# EAGLE design SD Card Shield (EAGLE 6.1)
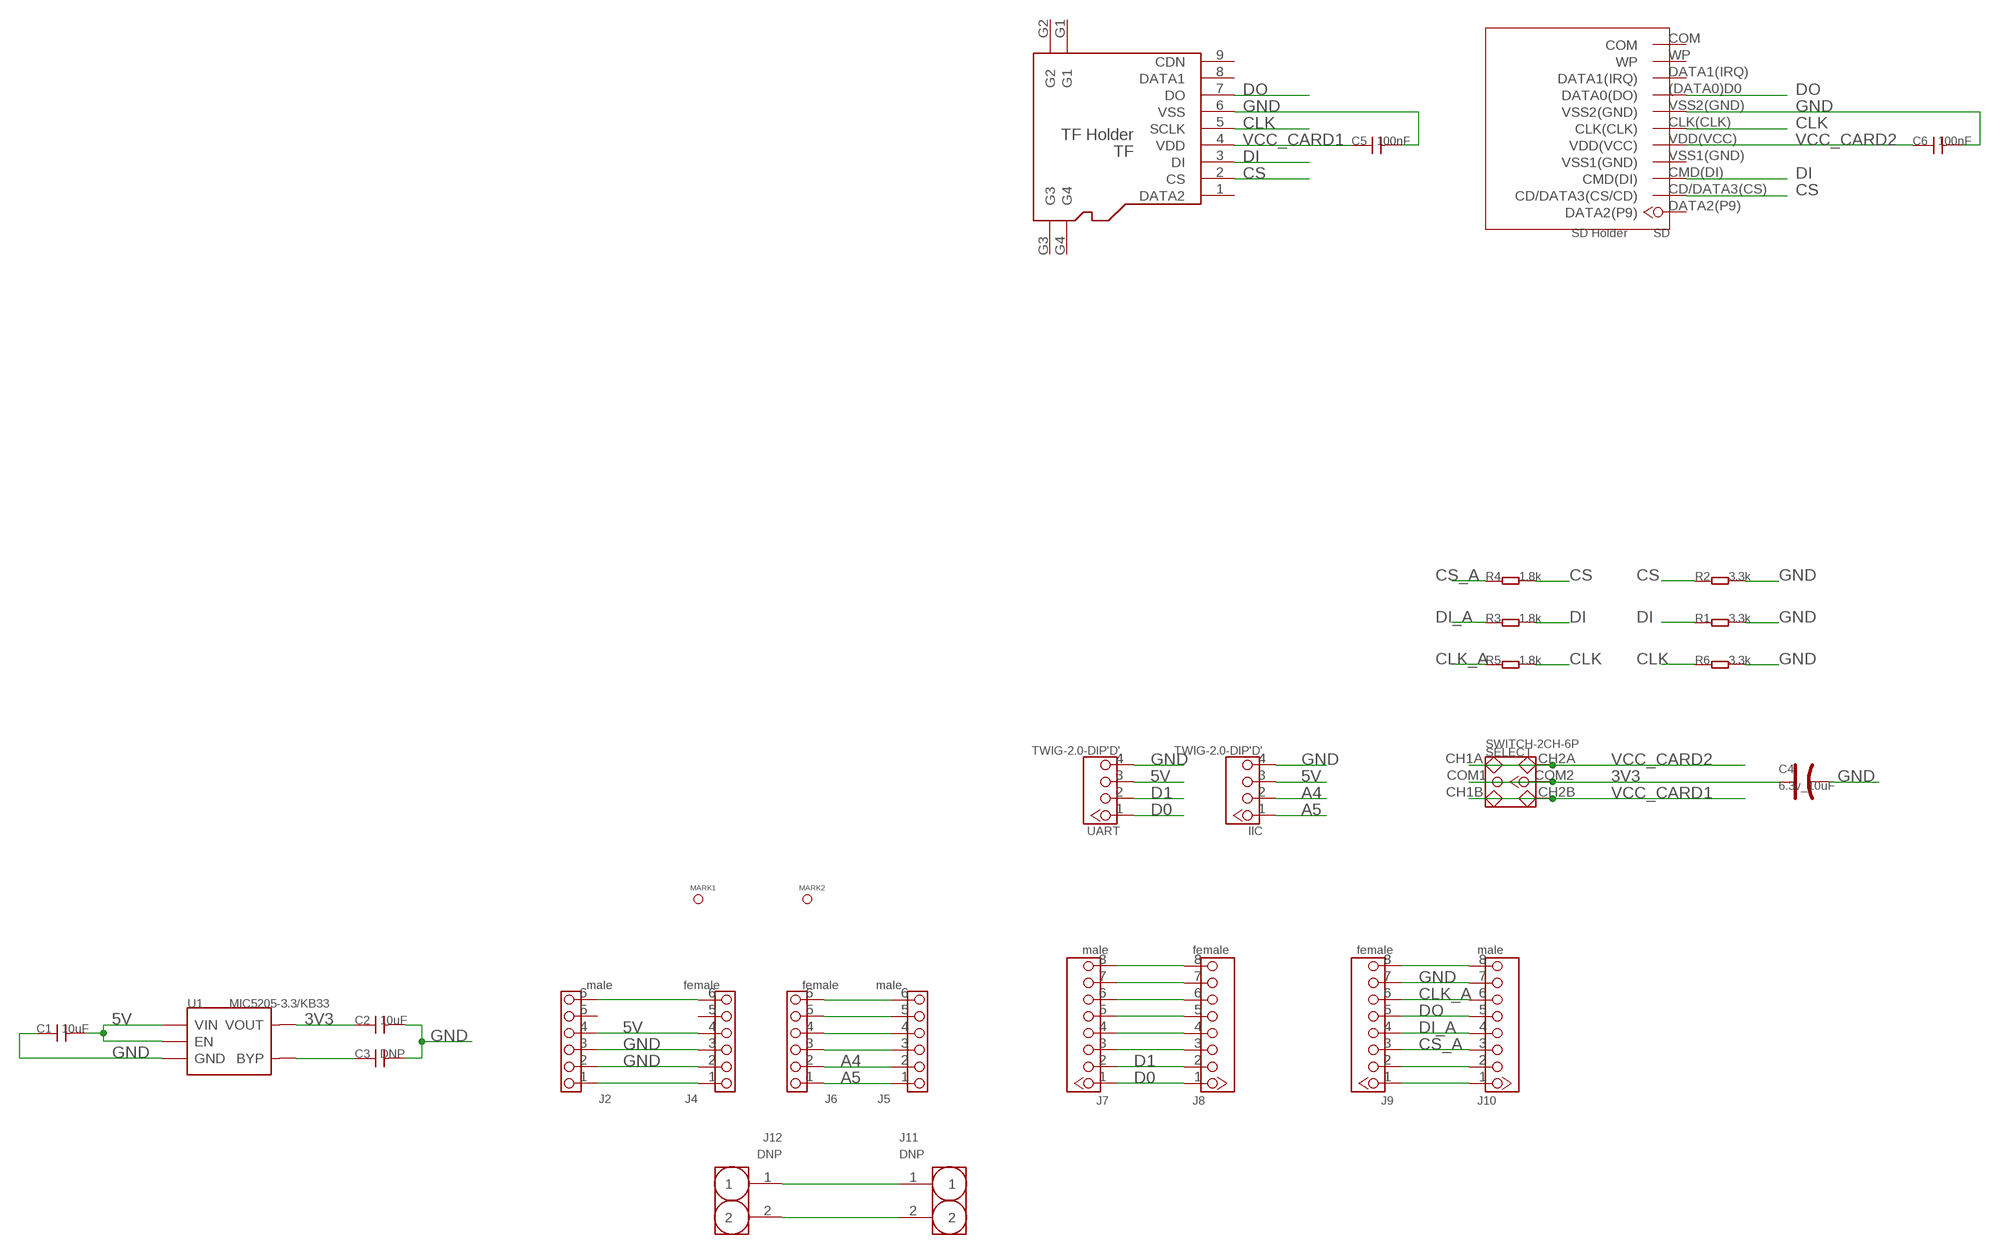
[diagram p0: schematic, sheet 1]

## Parts
C1  10uF  C-0805  [0805]
C2  10uF  C-0805  [0805]
C3  DNP  C-0603  [0603]
C4  6.3v_10uF  CAP-AVX-A  [AVX-A]
C5  100nF  C-0603  [0603]
C6  100nF  C-0603  [0603]
IIC  TWIG-2.0-DIP'D'  [2.0_1X4_90]
J2  male  HEADER-6PSTANDARD/2.54  [2.54_6P]
J4  female  HEADER-6PSTANDARD/2.54  [2.54_6P]
J5  male  HEADER-6PSTANDARD/2.54  [2.54_6P]
J6  female  HEADER-6PSTANDARD/2.54  [2.54_6P]
J7  male  HEADER-8P2.54  [CK_1X8]
J8  female  HEADER-8P2.54  [CK_1X8]
J9  female  HEADER-8P2.54  [CK_1X8]
J10  male  HEADER-8P2.54  [CK_1X8]
J11  DNP  HEADER-2P2.54  [65*35]
J12  DNP  HEADER-2P2.54  [65*35]
MARK1  DNP  PAD-MARK  [ROUND-MARK-1.0]
MARK2  DNP  PAD-MARK  [ROUND-MARK-1.0]
R1  3.3k  R-0603  [0603]
R2  3.3k  R-0603  [0603]
R3  1.8k  R-0603  [0603]
R4  1.8k  R-0603  [0603]
R5  1.8k  R-0603  [0603]
R6  3.3k  R-0603  [0603]
SD  SD Holder  SDCARDEXTDEVICE  [SDCARDEXTPACKAGE]
SELECT  SWITCH-2CH-6P  [6P-2CH-2.54-7.6X3.0]
TF  TF Holder  HOLDER-MICROSD-9P  [9P-SMD-W/-RING]
U1  MIC5205-3.3/KB33  MIC5205  [SOT23-5]
UART  TWIG-2.0-DIP'D'  [2.0_1X4_90]

## Nets
3V3: C2.1 C4.+ SELECT.COM1 SELECT.COM2 U1.5(VOUT)
5V: C1.2 IIC.3 J2.4 J4.4 U1.1(VIN) U1.3(EN) UART.3
A4: IIC.2 J5.2 J6.2
A5: IIC.1 J5.1 J6.1
CLK: R5.2 R6.1 SD.CLK(CLK) TF.5(SCLK)
CLK_A: J9.6 J10.6 R5.1
CS: R2.1 R4.2 SD.CD/DATA3(CS)(CD/DATA3(CS/CD)) TF.2(CS)
CS_A: J9.3 J10.3 R4.1
D0: J7.1 J8.1 UART.1
D1: J7.2 J8.2 UART.2
DI: R1.1 R3.2 SD.CMD(DI) TF.3(DI)
DI_A: J9.4 J10.4 R3.1
DO: J9.5 J10.5 SD.(DATA0)D0(DATA0(DO)) TF.7(DO)
GND: C1.1 C2.2 C3.2 C4.- C5.2 C6.2 IIC.4 J2.2 J2.3 J4.2 J4.3 J9.7 J10.7 R1.2 R2.2 R6.2 SD.VSS2(GND) TF.6(VSS) U1.2(GND) UART.4
N$1: J2.1 J4.1
N$2: J11.1 J12.1
N$3: J11.2 J12.2
N$4: C3.1 U1.4(BYP)
N$6: J2.6 J4.6
N$9: J5.3 J6.3
N$10: J5.4 J6.4
N$11: J5.5 J6.5
N$12: J5.6 J6.6
N$14: J7.3 J8.3
N$15: J7.4 J8.4
N$16: J7.5 J8.5
N$17: J7.6 J8.6
N$18: J7.7 J8.7
N$19: J7.8 J8.8
N$21: J9.2 J10.2
N$27: J9.8 J10.8
N$28: J9.1 J10.1
VCC_CARD1: C5.1 SELECT.CH1B SELECT.CH2B TF.4(VDD)
VCC_CARD2: C6.1 SD.VDD(VCC) SELECT.CH1A SELECT.CH2A
Unconnected: J2.5 J4.5 SD.COM SD.DATA1(IRQ) SD.DATA2(P9) SD.VSS1(GND) SD.WP TF.1(DATA2) TF.8(DATA1) TF.9(CDN) TF.G1 TF.G2 TF.G3 TF.G4

## Library data of the parts
C1-C3 C5 C6 = Discrete:C*: Ceramic Capacitors
C4 = Discrete:CAP*: Electrolytic Capacitors,Tantalum Capacitors and Super Capacitors
IIC UART = Connector:TWIG-2.0-DIP
J2 J4-J6 = Connector:HEADER-6P
J7-J10 = Connector:HEADER-8P
J11 J12 = Connector:HEADER-2P
MARK1 MARK2 = Discrete:PAD-MARK
R1-R6 = Discrete:R*
SD = SD card breakout:SDCARDEXTDEVICE
SELECT = Discrete:SWITCH-2CH-6P
TF = Connector:HOLDER-MICROSD-9P
U1 = IC:MIC5205: The MIC5205 is an efficient linear voltage regulator with ultra-low-noise output, very low dropout voltage (typically 17mV at light loads and 165mV at 150mA), and very low ground current (600µA at 100mA output). The MIC5205 offers better than 1% initial accuracy. datasheet here: http://www.micrel.com/product-info/prod/5205.shtml

## Net classes
0 default: clearance 0.152 mm

## Board
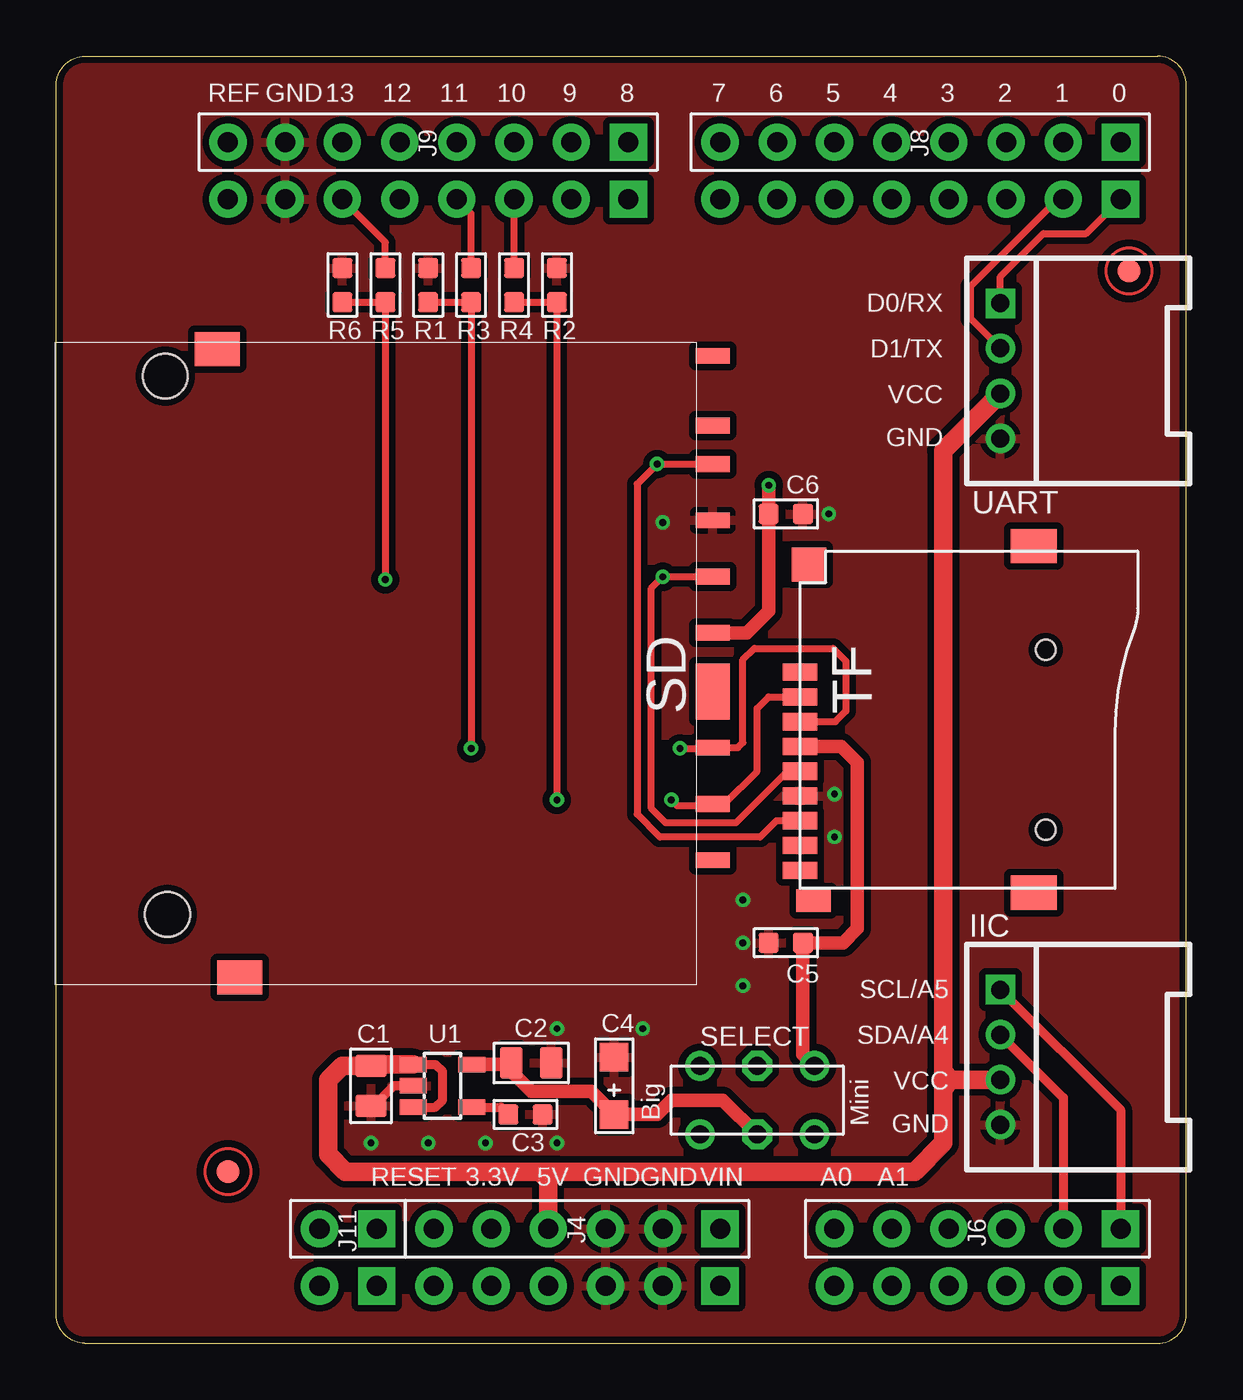
[diagram p1: board, top side]
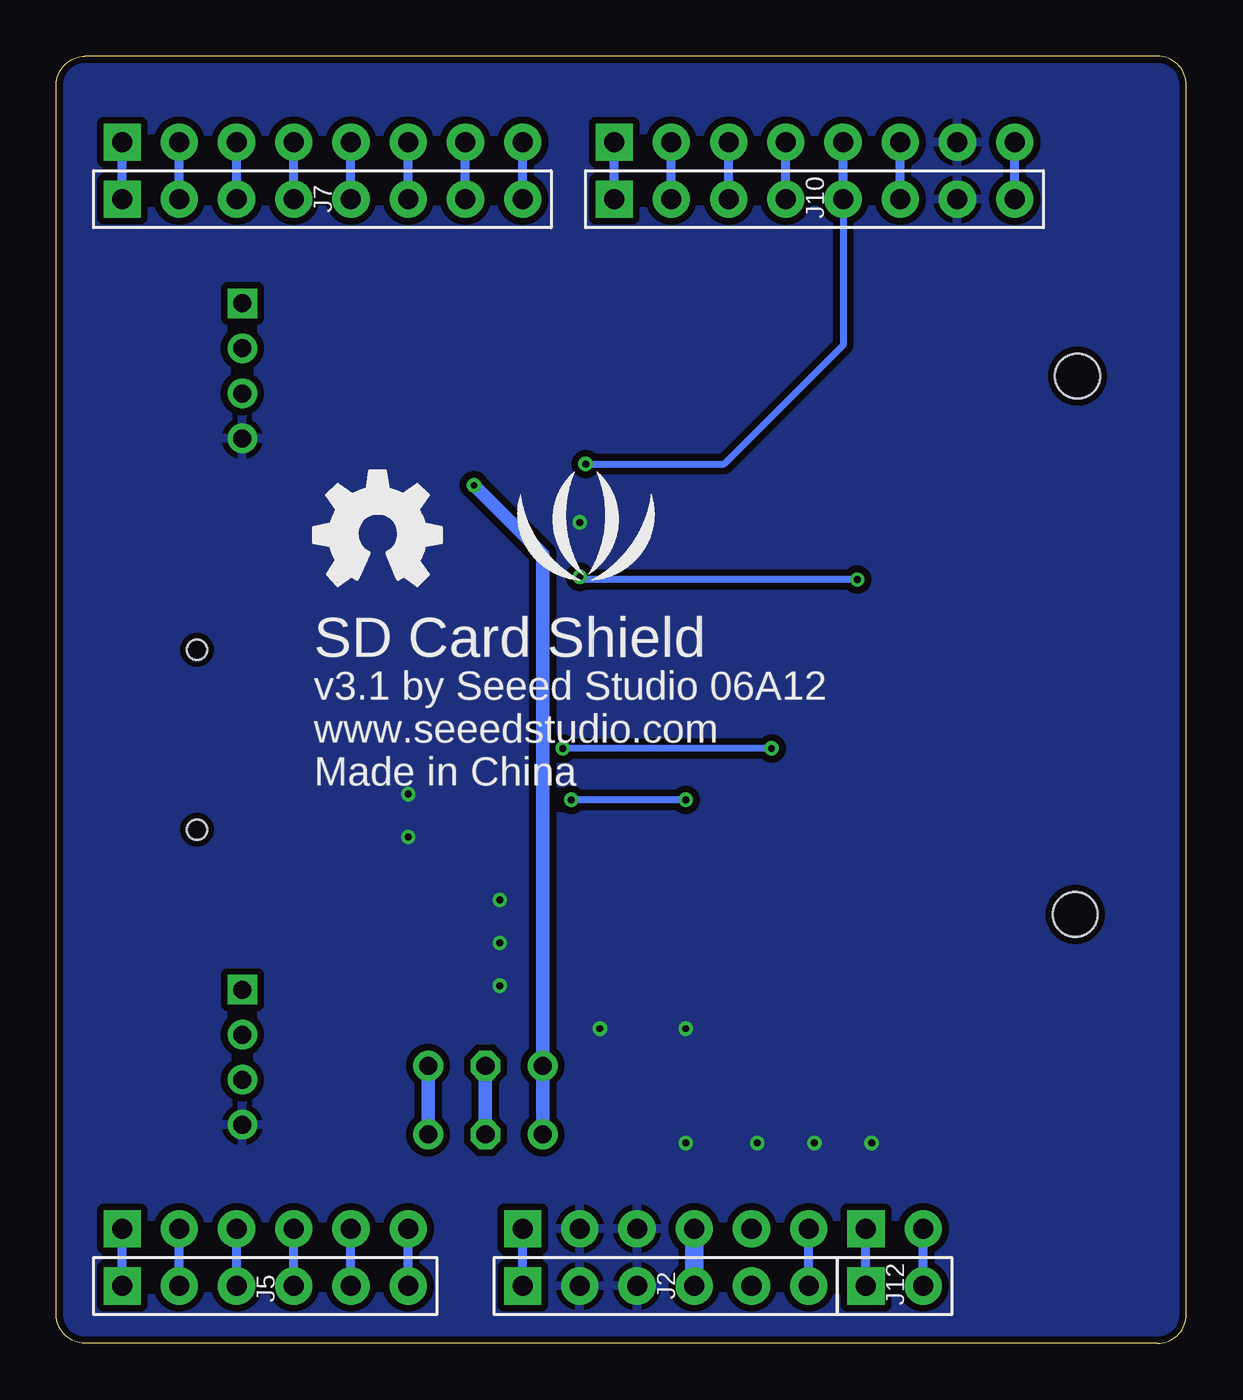
[diagram p2: board, bottom side, seen from below]

Size 50.16 x 57.15 mm. Coordinates in mm from the lower left corner, seen from the top.
Outline: 1.27,0 48.89,0 arc90 50.16,1.27 50.16,55.88 arc90 48.89,57.15 1.27,57.15 arc90 0,55.88 0,1.27 arc90 1.27,0
Copper layers (1*16): Top 0.035mm / dielectric 1.5mm / Bottom 0.035mm
Design rules: minimum track width 6mil, minimum drill 12mil, track to track 6mil, track to pad 6mil, pad to pad 6mil, via to via 6mil, smd to smd 0mil, copper to edge 10mil, drill to drill 10mil, minimum pad ring 10mil, minimum via ring 6mil, stop-mask expansion 2mil, vias tented up to drill 100mil, thermal gap 10mil
tKeepout: area 57.8,26.8 to 64.1,31.9

### Footprints (pad centres in the part's own frame; a part is rotated, then mirrored left to right if it is on the bottom)
0805 = smd 1.016 x 1.397: 1 -0.889,0; 2 0.889,0
0603 = smd 0.889 x 0.889: 1 -0.762,0; 2 0.762,0
AVX-A = smd 1.27 x 1.27: + -1.27,0; - 1.27,0
2.0_1X4_90 = drill 0.8 pad 1.27 square: 1 -3,0 | drill 0.8 pad 1.27: 2 -1,0; 3 1,0; 4 3,0
2.54_6P = drill 0.889 pad 1.651 square: 1 0,6.35 | drill 0.889 pad 1.651: 2 0,3.81; 3 0,1.27; 4 0,-1.27; 5 0,-3.81; 6 0,-6.35
CK_1X8 = drill 0.889 pad 1.651 square: 1 0,8.89 | drill 0.889 pad 1.651: 2 0,6.35; 3 0,3.81; 4 0,1.27; 5 0,-1.27; 6 0,-3.81; 7 0,-6.35; 8 0,-8.89
65*35 = drill 0.889 pad 1.651 square: 1 0,1.27 | drill 0.889 pad 1.651: 2 0,-1.27
ROUND-MARK-1.0 = smd 1.016 x 1.016: P$1 0,0
SDCARDEXTPACKAGE = smd 1.5 x 0.7: (DATA0)D0 -15.8,-9.2; CD/DATA3(CS) -15.8,5.9; CLK(CLK) -15.8,-4.2; CMD(DI) -15.8,3.4; DATA1(IRQ) -15.8,-10.9; DATA2(P9) -15.8,8.4; VDD(VCC) -15.8,-1.7; VSS2(GND) -15.8,-6.7; WP -15.8,-14 | smd 2 x 1.5: COM 6.2,-14.3; P$2 5.2,13.6 | smd 1.5 x 2.5: VSS1(GND) -15.8,0.9 | hole 2: 8.4,10.8; 8.5,-13.1
6P-2CH-2.54-7.6X3.0 = drill 0.813 pad 1.27: CH1A -1.524,2.54; CH1B -1.524,-2.54; CH2A 1.524,2.54; CH2B 1.524,-2.54 | drill 0.813 pad 1.27 octagon: COM1 -1.524,0; COM2 1.524,0
9P-SMD-W/-RING = smd 1.524 x 0.762: 1 0,4.4; 2 0,3.3; 3 0,2.2; 4 0,1.1; 5 0,0; 6 0,-1.1; 7 0,-2.2; 8 0,-3.3; 9 0,-4.4 | smd 1.524 x 1.016: G1 0.6,-5.746 | smd 2.032 x 1.524: G2 10.373,-5.4; G3 10.373,10 | smd 1.524 x 1.524: G4 0.392,9.181 | hole 0.889: 10.9,-2.6; 10.9,5.4
SOT23-5 = smd 0.69 x 1.2: 1 -0.95,-1.3; 2 0,-1.3; 3 0.95,-1.3; 4 0.95,1.3; 5 -0.95,1.3

### Placement (x,y rotation side)
C1  13.97,11.43 90 top
C2  21.08,12.45 0 top
C3  20.83,10.16 0 top
C4  24.77,11.43 90 top
C5  32.38,17.78 180 top
C6  32.38,36.83 0 top
IIC  41.91,12.7 270 top
J2  23.11,2.54 90 bottom
J4  23.11,5.08 270 top
J5  40.89,2.54 90 bottom
J6  40.89,5.08 270 top
J7  38.35,50.8 90 bottom
J8  38.35,53.34 270 top
J9  16.51,53.34 270 top
J10  16.51,50.8 90 bottom
J11  12.95,5.08 270 top
J12  12.95,2.54 90 bottom
MARK1  7.62,7.62 0 top
MARK2  47.62,47.62 0 top
R1  16.51,46.99 90 top
R2  22.23,46.99 90 top
R3  18.41,46.99 270 top
R4  20.32,46.99 270 top
R5  14.61,46.99 270 top
R6  12.7,46.99 90 top
SD  13.34,29.84 180 top
SELECT  31.12,10.79 90 top
TF  33.02,25.4 0 top
U1  17.14,11.43 270 top
U$1  [LOGO_SILK]  26.67,35.56 0 bottom
U$2  [OSHW_FILLX200_NOTEXT]  38.73,33.66 0 bottom
UART  41.91,43.18 270 top

### Tracks (layer width: path | path; a pad name or v marks a point on that pad's centre or on a via)
3V3
  Top 0.61: U1.5 20.13,12.38 C2.1 20.19,12.06 21.08,11.18 23.75,11.18 C4.+ 26.67,10.16 27.3,10.79 29.59,10.79 SELECT.COM1
  Bottom 0.61: SELECT.COM2 SELECT.COM1
5V
  Top 0.406: U1.3 16.83,10.48 17.14,10.79 17.14,12.06 16.83,12.38 U1.1
  Top 0.813: 21.84,7.49 21.84,7.62 | 21.84,7.62 21.72,7.62 | 21.72,7.62 21.46,7.62 | 21.46,7.62 12.83,7.62 12.07,8.38 12.07,11.68 12.7,12.32 C1.2 14.03,12.38 U1.1 | J4.4 21.84,7.24 | 21.84,7.24 21.84,7.49 | 21.84,7.49 21.72,7.62 | 21.84,7.62 22.23,7.62 | 22.23,7.62 38.1,7.62 39.37,8.89 39.37,11.3 | 39.37,11.3 39.37,12.06 | UART.3 39.37,39.64 39.37,12.06 | IIC.3 39.73,11.7 | 39.73,11.7 39.37,12.06 | 39.73,11.7 39.73,11.67 39.37,11.3 | 21.84,7.24 21.46,7.62 | 21.84,7.24 22.23,7.62
  Bottom 0.813: J4.4 J2.4
A4
  Top 0.406: IIC.2 44.7,10.91 J6.2
  Bottom 0.406: J5.2 J6.2
A5
  Top 0.406: IIC.1 47.24,10.37 J6.1
  Bottom 0.406: J5.1 J6.1
CLK  (via drill 0.3 pad 0.64)
  Top 0.305: TF.5 32.46,25.4 30.17,23.11 27.05,23.11 26.42,23.75 26.42,33.53 v26.92,34.04 29.13,34.04 SD.CLK(CLK) | R6.1 R5.2 v14.61,33.91
  Bottom 0.305: v14.61,33.91 26.8,33.91 v26.92,34.04
CLK_A
  Top 0.305: R5.1 14.61,48.9 J10.6
  Bottom 0.406: J10.6 J9.6
CS  (via drill 0.3 pad 0.64)
  Top 0.305: R4.2 R2.1 v22.23,24.13 | v27.3,24.13 27.56,23.88 29.07,23.88 SD.CD/DATA3(CS) 29.66,23.95 31.12,25.4 31.12,28.19 31.62,28.7 TF.2
  Bottom 0.305: v22.23,24.13 v27.3,24.13
CS_A
  Top 0.305: R4.1 J10.3
  Bottom 0.406: J10.3 J9.3
D0
  Top 0.305: UART.1 41.91,47.37 43.81,49.28 45.72,49.28 J7.1
  Bottom 0.406: J7.1 J8.1
D1
  Top 0.305: UART.2 40.6,45.49 40.6,46.95 44.45,50.8 J7.2
  Bottom 0.406: J7.2 J8.2
DI  (via drill 0.3 pad 0.64)
  Top 0.305: TF.3 34.59,27.6 35.05,28.07 35.05,30.29 34.48,30.86 30.99,30.86 30.48,30.35 30.48,26.67 30.26,26.45 SD.CMD(DI) 29.11,26.42 v27.69,26.42 | R1.1 R3.2 v18.41,26.42
  Bottom 0.305: v18.41,26.42 v27.69,26.42
DI_A
  Top 0.305: R3.1 18.41,50.16 J10.4
  Bottom 0.406: J10.4 J9.4
DO  (via drill 0.3 pad 0.64)
  Top 0.305: TF.7 31.96,23.2 31.24,22.48 26.8,22.48 25.78,23.5 25.78,38.16 v26.67,39.05 SD.(DATA0)D0
  Bottom 0.305: J10.5 15.24,44.32 20.52,39.05 v26.67,39.05
  Bottom 0.406: J10.5 J9.5
GND  (via drill 0.3 pad 0.64)
  Top 0.406: U1.2 14.99,11.43 13.97,10.41 C1.1
  other vias: 13.97,8.89 16.51,8.89 19.05,8.89 22.23,8.89 26.03,13.97 22.23,13.97 30.48,17.78 30.48,19.68 30.48,15.88 34.29,36.83 34.54,24.38 34.54,22.48 26.92,36.45
  pour Top (isolate 0.305): 0,57.15 0,0 50.16,0 50.16,57.15
  pour Bottom (isolate 0.305): 0,57.15 0,0 50.16,0 50.16,57.15
N$1
  Bottom 0.406: J2.1 J4.1
N$2
  Bottom 0.406: J12.1 J11.1
N$3
  Bottom 0.406: J12.2 J11.2
N$4
  Top 0.406: U1.4 19.75,10.48 C3.1
N$6
  Bottom 0.406: J2.6 J4.6
N$9
  Bottom 0.406: J5.3 J6.3
N$10
  Bottom 0.406: J5.4 J6.4
N$11
  Bottom 0.406: J5.5 J6.5
N$12
  Bottom 0.406: J5.6 J6.6
N$14
  Bottom 0.406: J7.3 J8.3
N$15
  Bottom 0.406: J7.4 J8.4
N$16
  Bottom 0.406: J7.5 J8.5
N$17
  Bottom 0.406: J7.6 J8.6
N$18
  Bottom 0.406: J7.7 J8.7
N$19
  Bottom 0.406: J7.8 J8.8
N$21
  Bottom 0.406: J10.2 J9.2
N$27
  Bottom 0.406: J10.8 J9.8
N$28
  Bottom 0.406: J10.1 J9.1
VCC_CARD1
  Top 0.61: TF.4 34.84,26.5 35.56,25.78 35.56,18.41 34.92,17.78 C5.1 33.15,12.83 SELECT.CH2B
  Bottom 0.61: SELECT.CH1B SELECT.CH2B
VCC_CARD2  (via drill 0.3 pad 0.64)
  Top 0.61: SD.VDD(VCC) 30.66,31.55 31.62,32.51 C6.1 v31.62,38.1
  Bottom 0.61: v31.62,38.1 28.58,35.05 SELECT.CH2A SELECT.CH1A

### Text on the board
tPlace: REF | GND | 13 | 12 | 11 | 10 | 9 | 8 | 7 | 6 | 5 | 4 | 3 | 2 | 1 | 0 | D0/RX | D1/TX | VCC | GND | SCL/A5 | SDA/A4 | VCC | Big | Mini | GND | RESET | 3.3V | 5V | GND | GND | VIN | A0 | A1
bPlace: SD Card Shield | v3.1 by Seeed Studio 06A12 | www.seeedstudio.com | Made in China